# EasyEDA schematic PCB_VIP_Master BMS 2026.json
TITLE: MASTER BOARD; REV: 1.0; Date: 2026-07-15; Sheet: 1/1; Company: HCMUTE
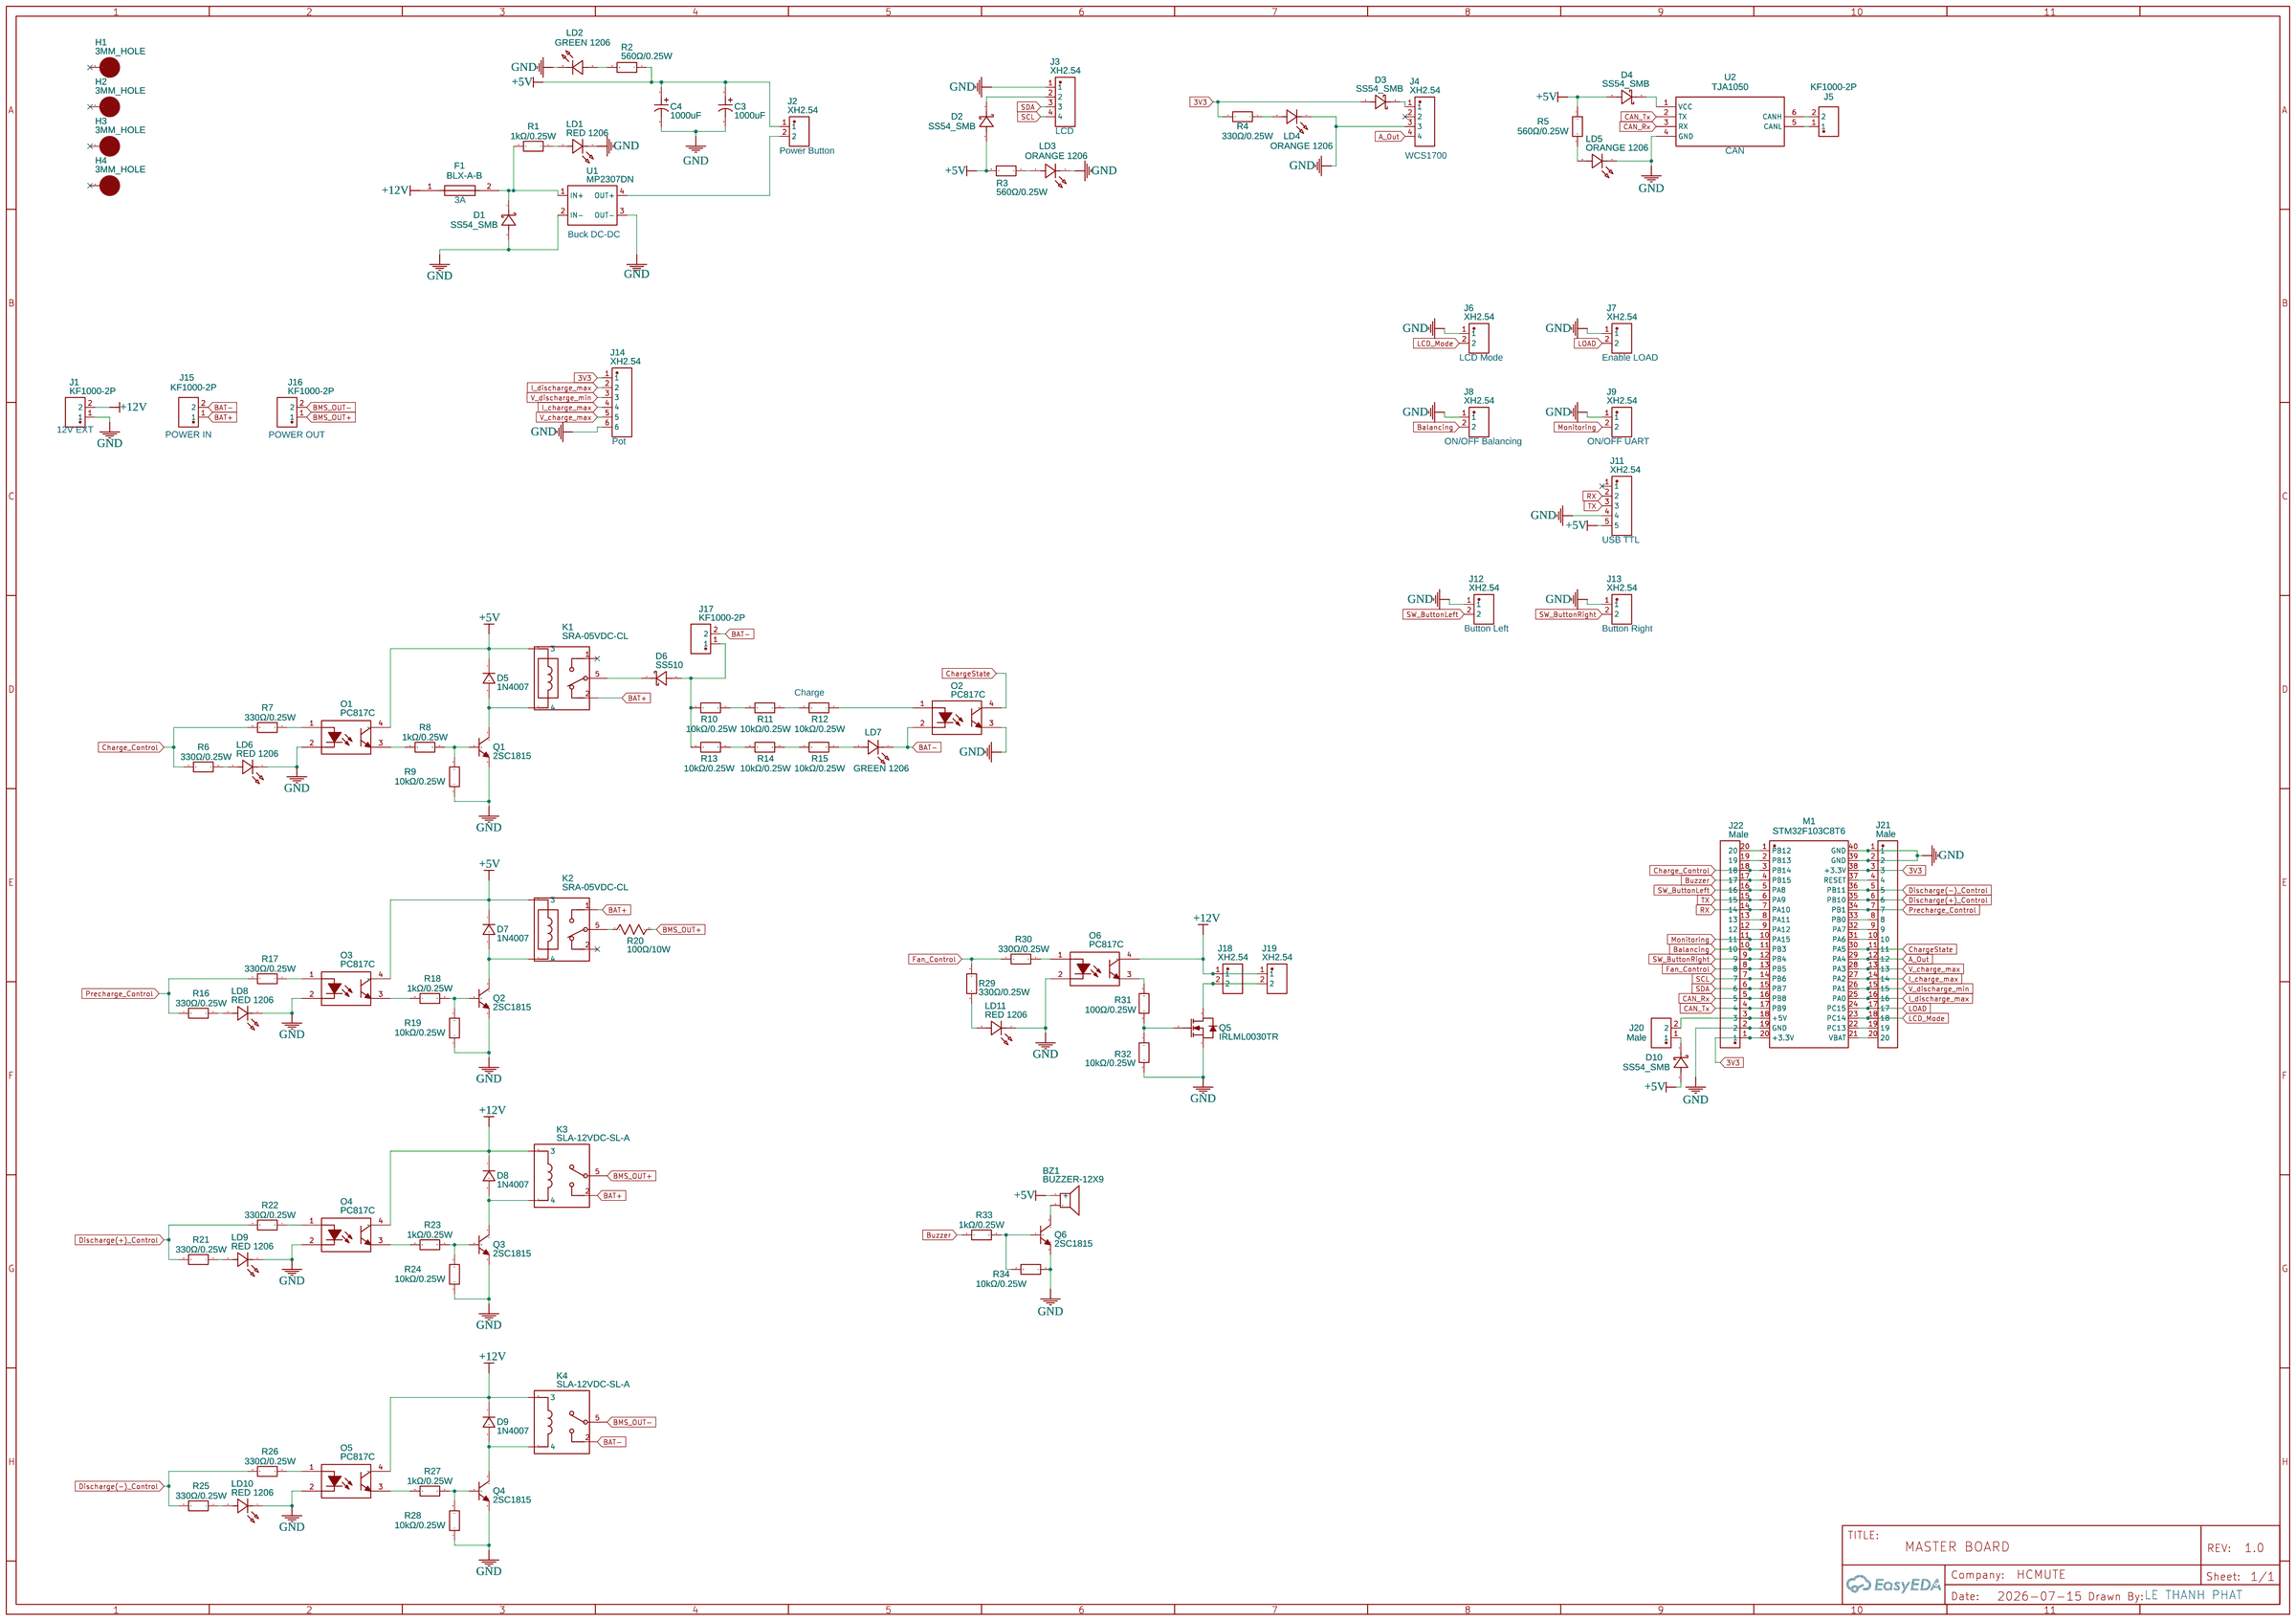
[diagram p0: schematic sheet]

## Parts
BZ1  BUZZER-12X9  [BUZ-TH_BD12.0-P7.60-D0.6-FD]
C3  1000uF  [CAP-SMD_BD12.5-L13.0-W13.0-LS14.0-FD]
C4  1000uF  [CAP-SMD_BD12.5-L13.0-W13.0-LS14.0-FD]
D1  SS54_SMB  [SMB_L4.3-W3.6-LS5.4-RD]
D2  SS54_SMB  [SMB_L4.3-W3.6-LS5.4-RD]
D3  SS54_SMB  [SMB_L4.3-W3.6-LS5.4-RD]
D4  SS54_SMB  [SMB_L4.3-W3.6-LS5.4-RD]
D5  1N4007  [SMA_L4.4-W2.8-LS5.4-RD]
D6  SS510  [SMC_L6.9-W5.9-LS7.9-RD]
D7  1N4007  [SMA_L4.4-W2.8-LS5.4-RD]
D8  1N4007  [SMA_L4.4-W2.8-LS5.4-RD]
D9  1N4007  [SMA_L4.4-W2.8-LS5.4-RD]
D10  SS54_SMB  [SMB_L4.3-W3.6-LS5.4-RD]
F1  BLX-A-B  [FUSE-TH_BLX-A-B]
H1  3MM_HOLE  [PKG-SCREW-MOUNTING-HOLE-3MM]
H2  3MM_HOLE  [PKG-SCREW-MOUNTING-HOLE-3MM]
H3  3MM_HOLE  [PKG-SCREW-MOUNTING-HOLE-3MM]
H4  3MM_HOLE  [PKG-SCREW-MOUNTING-HOLE-3MM]
J1  KF1000-2P  [CONN-TH_KF1000-2P]
J2  XH2.54  [CONN-TH_2P-P2.54_ZX-XH2.54-2PZZ-Y]
J3  XH2.54  [CONN-TH_4P-P2.50_4PIN]
J4  XH2.54  [CONN-TH_4P-P2.50_4PIN]
J5  KF1000-2P  [CONN-TH_KF1000-2P]
J6  XH2.54  [CONN-TH_2P-P2.50_HX25003-2A]
J7  XH2.54  [CONN-TH_2P-P2.50_HX25003-2A]
J8  XH2.54  [CONN-TH_2P-P2.50_HX25003-2A]
J9  XH2.54  [CONN-TH_2P-P2.50_HX25003-2A]
J11  XH2.54  [CONN-TH_5P-P2.50_ZX-XH2.54-5PZZ]
J12  XH2.54  [CONN-TH_2P-P2.50_HX25003-2A]
J13  XH2.54  [CONN-TH_2P-P2.50_HX25003-2A]
J14  XH2.54  [CONN-TH_6P-P2.50_ZX-XH2.54-6PZZ]
J15  KF1000-2P  [CONN-TH_KF1000-2P]
J16  KF1000-2P  [CONN-TH_KF1000-2P]
J17  KF1000-2P  [CONN-TH_KF1000-2P]
J18  XH2.54  [CONN-TH_2P-P2.50_HX25003-2A]
J19  XH2.54  [CONN-TH_2P-P2.50_HX25003-2A]
J20  Male  [HDR-TH_2P-P2.54-V-M-3]
J21  Male  [HDR-TH_20P-P2.54-V-M-1]
J22  Male  [HDR-TH_20P-P2.54-V-M-1]
K1  SRA-05VDC-CL  [RELAY-TH_SRA-X-CX]
K2  SRA-05VDC-CL  [RELAY-TH_SRA-X-CX]
K3  SLA-12VDC-SL-A  [RELAY-TH_SLA-XXVDC-XL-A]
K4  SLA-12VDC-SL-A  [RELAY-TH_SLA-XXVDC-XL-A]
LD1  RED 1206  [LED1206-RD]
LD2  GREEN 1206  [LED1206-RD]
LD3  ORANGE 1206  [LED1206-RD]
LD4  ORANGE 1206  [LED1206-RD]
LD5  ORANGE 1206  [LED1206-RD]
LD6  RED 1206  [LED1206-RD]
LD7  GREEN 1206  [LED1206-RD]
LD8  RED 1206  [LED1206-RD]
LD9  RED 1206  [LED1206-RD]
LD10  RED 1206  [LED1206-RD]
LD11  RED 1206  [LED1206-RD]
M1  STM32F103C8T6  [CONN-TH_L53.3-W22.9_STM32F103C8T6-CARD]
O1  PC817C  [SOP-4_L6.5-W4.6-P2.54-LS10.2-TL]
O2  PC817C  [SOP-4_L6.5-W4.6-P2.54-LS10.2-TL]
O3  PC817C  [SOP-4_L6.5-W4.6-P2.54-LS10.2-TL]
O4  PC817C  [SOP-4_L6.5-W4.6-P2.54-LS10.2-TL]
O5  PC817C  [SOP-4_L6.5-W4.6-P2.54-LS10.2-TL]
O6  PC817C  [SOP-4_L6.5-W4.6-P2.54-LS10.2-TL]
Q1  2SC1815  [SOT-23-3_L2.9-W1.3-P0.95-LS2.4-BR]
Q2  2SC1815  [SOT-23-3_L2.9-W1.3-P0.95-LS2.4-BR]
Q3  2SC1815  [SOT-23-3_L2.9-W1.3-P0.95-LS2.4-BR]
Q4  2SC1815  [SOT-23-3_L2.9-W1.3-P0.95-LS2.4-BR]
Q5  IRLML0030TR  [SOT-23-3_L2.9-W1.3-P0.95-LS2.4-BR]
Q6  2SC1815  [SOT-23-3_L2.9-W1.3-P0.95-LS2.4-BR]
R1  1kΩ/0.25W  [R1206]
R2  560Ω/0.25W  [R1206]
R3  560Ω/0.25W  [R1206]
R4  330Ω/0.25W  [R1206]
R5  560Ω/0.25W  [R1206]
R6  330Ω/0.25W  [R1206]
R7  330Ω/0.25W  [R1206]
R8  1kΩ/0.25W  [R1206]
R9  10kΩ/0.25W  [R1206]
R10  10kΩ/0.25W  [R1206]
R11  10kΩ/0.25W  [R1206]
R12  10kΩ/0.25W  [R1206]
R13  10kΩ/0.25W  [R1206]
R14  10kΩ/0.25W  [R1206]
R15  10kΩ/0.25W  [R1206]
R16  330Ω/0.25W  [R1206]
R17  330Ω/0.25W  [R1206]
R18  1kΩ/0.25W  [R1206]
R19  10kΩ/0.25W  [R1206]
R20  100Ω/10W  [DAYTON AUDIO 4.7 OHM 10W PRECISION AUDIO GRADE RESISTOR]
R21  330Ω/0.25W  [R1206]
R22  330Ω/0.25W  [R1206]
R23  1kΩ/0.25W  [R1206]
R24  10kΩ/0.25W  [R1206]
R25  330Ω/0.25W  [R1206]
R26  330Ω/0.25W  [R1206]
R27  1kΩ/0.25W  [R1206]
R28  10kΩ/0.25W  [R1206]
R29  330Ω/0.25W  [R1206]
R30  330Ω/0.25W  [R1206]
R31  100Ω/0.25W  [R1206]
R32  10kΩ/0.25W  [R1206]
R33  1kΩ/0.25W  [R1206]
R34  10kΩ/0.25W  [R1206]
U1  MP2307DN  [MP2307DN_DC_DC_DOWN]
U2  TJA1050  [CANBUSTJA1050]

## Library data of the parts
BZ1 = BUZZER-12X9: Contributor: lcsc; Supplier: LCSC; Supplier Part: C9900016920; Manufacturer: null; Manufacturer Part: buzzer-12X9; JLCPCB Part Class: Extended Part
C3 C4 = XT1000UF25V90RV0154: Supplier: LCSC; Supplier Part: C5138964; Manufacturer: KNSCHA(科尼盛); JLCPCB Part Class: Extended Part; Contributor: lcsc
D1-D4 D10 = SS54_C5200096: Supplier: LCSC; Supplier Part: C5200096; Manufacturer: HXY MOSFET(华轩阳电子); Manufacturer Part: SS54; Contributor: lcsc; JLCPCB Part Class: Extended Part
D5 D7-D9 = 1N4007_C126233: Contributor: LCSC; Supplier: LCSC; Supplier Part: C126233; Manufacturer: SHIKUES(时科); JLCPCB Part Class: Extended Part
D6 = SS510SMC: Contributor: LCSC; Supplier: LCSC; Supplier Part: C511859; Manufacturer: BORN(伯恩半导体); JLCPCB Part Class: Extended Part
F1 = BLX-A-B: Supplier: LCSC; Supplier Part: C41371862; Manufacturer: XFCN(兴飞); Contributor: lcsc; JLCPCB Part Class: Extended Part
H1-H4 = 3MM_HOLE: THT 3MM SCREW MOUNTING HOLE; Contributor: aris hartanto; subpart_no: 1
J1 J5 J15-J17 = KF1000-2P: Supplier: LCSC; Supplier Part: C9900149030; Manufacturer: null; JLCPCB Part Class: Extended Part; Contributor: lcsc
J2 = ZX-XH2.54-2PZZ-Y: Supplier: LCSC; Supplier Part: C22388684; Manufacturer: Megastar(兆星); Contributor: lcsc; JLCPCB Part Class: Extended Part
J3 J4 = ZX-XH2.54-4PZZ: Contributor: lcsc; Supplier: LCSC; Supplier Part: C7429634; Manufacturer: Megastar(兆星); JLCPCB Part Class: Extended Part
J6-J9 J12 J13 J18 J19 = ZX-XH2.54-2PZZ: Supplier: LCSC; Supplier Part: C7429632; Manufacturer: Megastar(兆星); Contributor: lcsc
J11 = ZX-XH2.54-5PZZ: Supplier: LCSC; Supplier Part: C7429635; Manufacturer: Megastar(兆星); JLCPCB Part Class: Extended Part; Contributor: lcsc
J14 = ZX-XH2.54-6PZZ: Supplier: LCSC; Supplier Part: C7429636; Manufacturer: Megastar(兆星); JLCPCB Part Class: Extended Part; Contributor: lcsc
J20 = HX PZ2.54-1X2P ZZ: Supplier: LCSC; Supplier Part: C32713268; Manufacturer: hanxia(韩下); Manufacturer Part: HX PZ2.54-1x2P ZZ; Contributor: lcsc; JLCPCB Part Class: Extended Part
J21 J22 = HX PZ2.54-1X20P ZZ: Supplier: LCSC; Supplier Part: C42372512; Manufacturer: hanxia(韩下); Manufacturer Part: HX PZ2.54-1x20P ZZ; Contributor: lcsc
K1 K2 = SRA-05VDC-CL: Contributor: LCSC; Supplier: LCSC; Supplier Part: C99666; Manufacturer: 松乐; JLCPCB Part Class: Extended Part
K3 K4 = SLA-12VDC-SL-A: Supplier: LCSC; Manufacturer: 松乐; Supplier Part: C55194; JLCPCB Part Class: Extended Part
LD1-LD11 = TJ-S3216EX9T5ALC2R-A5: Supplier: LCSC; Supplier Part: C48689667; Manufacturer: TOGIALED(统佳); JLCPCB Part Class: Extended Part; Contributor: lcsc
M1 = LCKFB-DKX-STM32F103C8T6: Supplier: LCSC; Supplier Part: C22396880; Manufacturer: 立创开发板; Contributor: lcsc; JLCPCB Part Class: Extended Part
O1-O6 = PC817C_C22447129: Supplier: LCSC; Supplier Part: C22447129; Manufacturer: JSMSEMI(杰盛微); JLCPCB Part Class: Extended Part; Contributor: lcsc
Q1-Q4 Q6 = 2SC1815_C2914411: Supplier: LCSC; Supplier Part: C2914411; Manufacturer: MSKSEMI(美森科); Contributor: lcsc
Q5 = IRLML0030TRPBF-G: Supplier: LCSC; Supplier Part: C7603368; Manufacturer: TECH PUBLIC(台舟); Contributor: lcsc; JLCPCB Part Class: Extended Part
R1-R19 R21-R34 = HOAR1206-1/4W-1KR-1%-TCR50: Supplier: LCSC; Supplier Part: C2912605; Manufacturer: Milliohm(毫欧); Manufacturer Part: HoAR1206-1/4W-1KR-1%-TCR50; JLCPCB Part Class: Extended Part; Contributor: lcsc
R20 = DAYTON AUDIO 4.7 OHM 10W PRECISION AUDIO GRADE RESISTOR COPY: Supplier Part: 004-4.7; Supplier: Parts Express; Contributor: 01-0077
U1 = MP2307DN: Contributor: Владислав Красильников
U2 = CANBUSTJA1050 COPY: Contributor: m64348356

## Nets
3V3: D3.2 J14.1 J21.3 J22.1 M1.20(+3.3V) M1.38(+3.3V) R4.2
+5V: BZ1.1(+) C3.1 C4.1 D2.2 D4.2 D5.1 D7.1 D10.2 J2.1 J11.5 K1.3 K2.3 O1.4(COL) O3.4(COL) R2.1 R3.2 R5.1
+12V: D8.1 D9.1 F1.1 J1.2 J18.1 J19.1 K3.3 K4.3 O4.4(COL) O5.4(COL) O6.4(COL)
GND: C3.2 C4.2 D1.2 J1.1 J3.1 J4.3 J6.1 J7.1 J8.1 J9.1 J11.4 J12.1 J13.1 J14.6 J21.1 J21.2 J22.2 LD1.1(C) LD2.1(C) LD3.1(C) LD4.1(C) LD5.1(C) LD6.1(C) LD8.1(C) LD9.1(C) LD10.1(C) LD11.1(C) M1.19(GND) M1.39(GND) M1.40(GND) O1.2(CAT) O2.3(EM) O3.2(CAT) O4.2(CAT) O5.2(CAT) O6.2(CAT) Q1.2(E) Q2.2(E) Q3.2(E) Q4.2(E) Q5.2(S) Q6.2(E) R9.1 R19.1 R24.1 R28.1 R32.2 R34.1 U1.2(IN-) U1.3(OUT-) U2.4(GND)
A_Out: J4.4 J21.12 M1.29(PA4)
Balancing: J8.2 J22.10 M1.11(PB3)
BAT+: J15.1 K1.2 K2.1 K3.2
BAT-: J15.2 J17.2 K4.2 LD7.1(C) O2.2(CAT)
BMS_OUT+: J16.1 K3.5 R20.2
BMS_OUT-: J16.2 K4.5
Buzzer: J22.17 M1.4(PB15) R33.2
CAN_Rx: J22.5 M1.16(PB8) U2.3(RX)
CAN_Tx: J22.4 M1.17(PB9) U2.2(TX)
Charge_Control: J22.18 M1.3(PB14) R6.2 R7.2
ChargeState: J21.11 M1.30(PA5) O2.4(COL)
Discharge(+)_Control: J21.6 M1.35(PB10) R21.2 R22.2
Discharge(-)_Control: J21.5 M1.36(PB11) R25.2 R26.2
Fan_Control: J22.8 M1.13(PB5) R29.2 R30.2
I_charge_max: J14.4 J21.14 M1.27(PA2)
I_discharge_max: J14.2 J21.16 M1.25(PA0)
LCD_Mode: J6.2 J21.18 M1.23(PC14)
LOAD: J7.2 J21.17 M1.24(PC15)
Monitoring: J9.2 J22.11 M1.10(PA15)
Precharge_Control: J21.7 M1.34(PB1) R16.2 R17.2
RX: J11.2 J22.14 M1.7(PA10)
SCL: J3.4 J22.7 M1.14(PB6)
SDA: J3.3 J22.6 M1.15(PB7)
SW_ButtonLeft: J12.2 J22.16 M1.5(PA8)
SW_ButtonRight: J13.2 J22.9 M1.12(PB4)
TX: J11.3 J22.15 M1.6(PA9)
V_charge_max: J14.5 J21.13 M1.28(PA3)
V_discharge_min: J14.3 J21.15 M1.26(PA1)
Net-(BZ1-2): BZ1.2 Q6.3(C)
Net-(D1-1): D1.1 F1.2 R1.2 U1.1(IN+)
Net-(D2-1): D2.1 J3.2
Net-(D3-1): D3.1 J4.1
Net-(D4-1): D4.1 U2.1(VCC)
Net-(D5-2): D5.2 K1.4 Q1.3(C)
Net-(D6-1): D6.1(C) K1.5
Net-(D6-2): D6.2(A) J17.1 R10.2 R13.2
Net-(D7-2): D7.2 K2.4 Q2.3(C)
Net-(D8-2): D8.2 K3.4 Q3.3(C)
Net-(D9-2): D9.2 K4.4 Q4.3(C)
Net-(D10-1): D10.1 J20.1
Net-(J2-2): J2.2 U1.4(OUT+)
Net-(J5-1): J5.1 U2.5(CANL)
Net-(J5-2): J5.2 U2.6(CANH)
Net-(J18-2): J18.2 J19.2 Q5.3(D)
Net-(J20-2): J20.2 J22.3 M1.18(+5V)
Net-(J21-4): J21.4 M1.37(RESET)
Net-(J21-8): J21.8 M1.33(PB0)
Net-(J21-9): J21.9 M1.32(PA7)
Net-(J21-10): J21.10 M1.31(PA6)
Net-(J21-19): J21.19 M1.22(PC13)
Net-(J21-20): J21.20 M1.21(VBAT)
Net-(J22-12): J22.12 M1.9(PA12)
Net-(J22-13): J22.13 M1.8(PA11)
Net-(J22-19): J22.19 M1.2(PB13)
Net-(J22-20): J22.20 M1.1(PB12)
Net-(K2-5): K2.5 R20.1
Net-(LD1-2): LD1.2(A) R1.1
Net-(LD2-2): LD2.2(A) R2.2
Net-(LD3-2): LD3.2(A) R3.1
Net-(LD4-2): LD4.2(A) R4.1
Net-(LD5-2): LD5.2(A) R5.2
Net-(LD6-2): LD6.2(A) R6.1
Net-(LD7-2): LD7.2(A) R15.1
Net-(LD8-2): LD8.2(A) R16.1
Net-(LD9-2): LD9.2(A) R21.1
Net-(LD10-2): LD10.2(A) R25.1
Net-(LD11-2): LD11.2(A) R29.1
Net-(O1-1): O1.1(AN) R7.1
Net-(O1-3): O1.3(EM) R8.2
Net-(O2-1): O2.1(AN) R12.1
Net-(O3-1): O3.1(AN) R17.1
Net-(O3-3): O3.3(EM) R18.2
Net-(O4-1): O4.1(AN) R22.1
Net-(O4-3): O4.3(EM) R23.2
Net-(O5-1): O5.1(AN) R26.1
Net-(O5-3): O5.3(EM) R27.2
Net-(O6-1): O6.1(AN) R30.1
Net-(O6-3): O6.3(EM) R31.1
Net-(Q1-1): Q1.1(B) R8.1 R9.2
Net-(Q2-1): Q2.1(B) R18.1 R19.2
Net-(Q3-1): Q3.1(B) R23.1 R24.2
Net-(Q4-1): Q4.1(B) R27.1 R28.2
Net-(Q5-1): Q5.1(G) R31.2 R32.1
Net-(Q6-1): Q6.1(B) R33.1 R34.2
Net-(R10-1): R10.1 R11.2
Net-(R11-1): R11.1 R12.2
Net-(R13-1): R13.1 R14.2
Net-(R14-1): R14.1 R15.2

Not connected (* = marked no-connect by the designer): H1 1*; H2 1*; H3 1*; H4 1*; J4 2*; J11 1*; K1 1*; K2 2*

## Notes on the sheet
- LCD
- Power Button
- WCS1700
- CAN
- 3A
- Buck DC-DC
- LCD Mode
- Enable LOAD
- 12V EXT
- POWER IN
- POWER OUT
- Pot
- ON/OFF Balancing
- ON/OFF UART
- USB TTL
- Button Left
- Button Right
- Charge
- LE THANH PHAT
